# Altium schematic sheet Sheet_1_2024-02-07.schdoc
size 47 x 32 mm
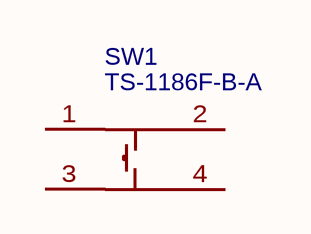
[diagram p0: Sheet_1_2024-02-07.schdoc]

## Parts
SW1  TS-1186F-B-A  [KEY-SMD_TS-1186F-C-A]

## Nets

Not connected (* = marked no-connect by the designer): SW1 1 2 3 4

## Library data of the parts
SW1 = TS-1186F-B-A: Manufacturer: XKB Connectivity(中国星坤); Contributor: LCSC; Supplier: LCSC; Supplier Part: C908470; Manufacturer Part: TS-1186F-B-A; JLCPCB Part Class: Extended Part; spicePre: S; spiceSymbolName: TS-1186F-B-A